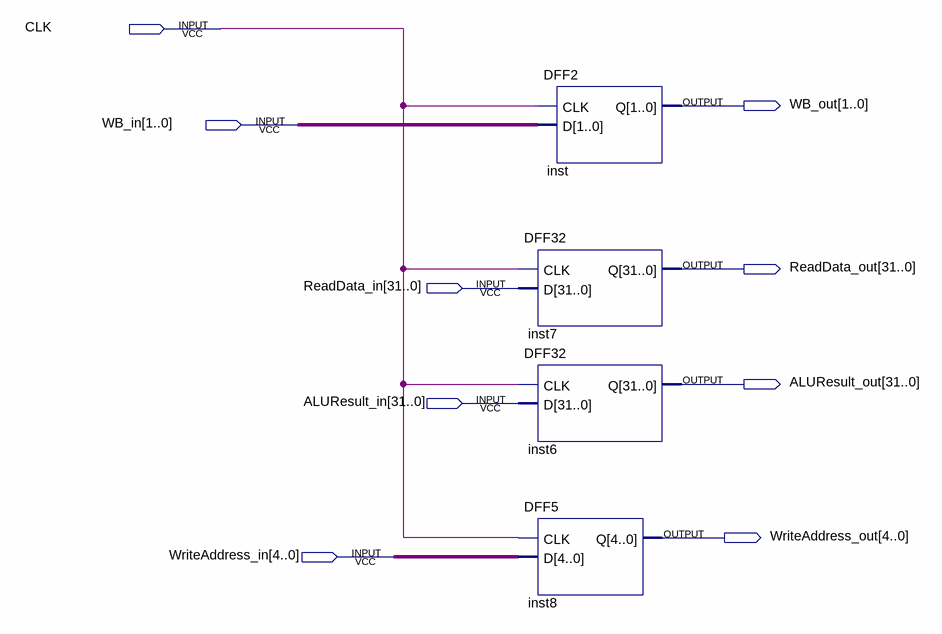
[diagram p0: schematic sheet]
// Quartus schematic MEM_WB.bdf as structural Verilog: 4 symbols, 9 pins
module MEM_WB (
  input  CLK,
  input  [1:0] WB_in,
  input  [31:0] ReadData_in,
  input  [31:0] ALUResult_in,
  input  [4:0] WriteAddress_in,
  output [1:0] WB_out,
  output [31:0] ReadData_out,
  output [31:0] ALUResult_out,
  output [4:0] WriteAddress_out
);

  DFF2 inst (.CLK(CLK), .D(WB_in), .Q(WB_out));
  DFF32 inst7 (.CLK(CLK), .D(ReadData_in), .Q(ReadData_out));
  DFF32 inst6 (.CLK(CLK), .D(ALUResult_in), .Q(ALUResult_out));
  DFF5 inst8 (.CLK(CLK), .D(WriteAddress_in), .Q(WriteAddress_out));
endmodule
